# EAGLE design flash programmer (EAGLE 7.4.0)
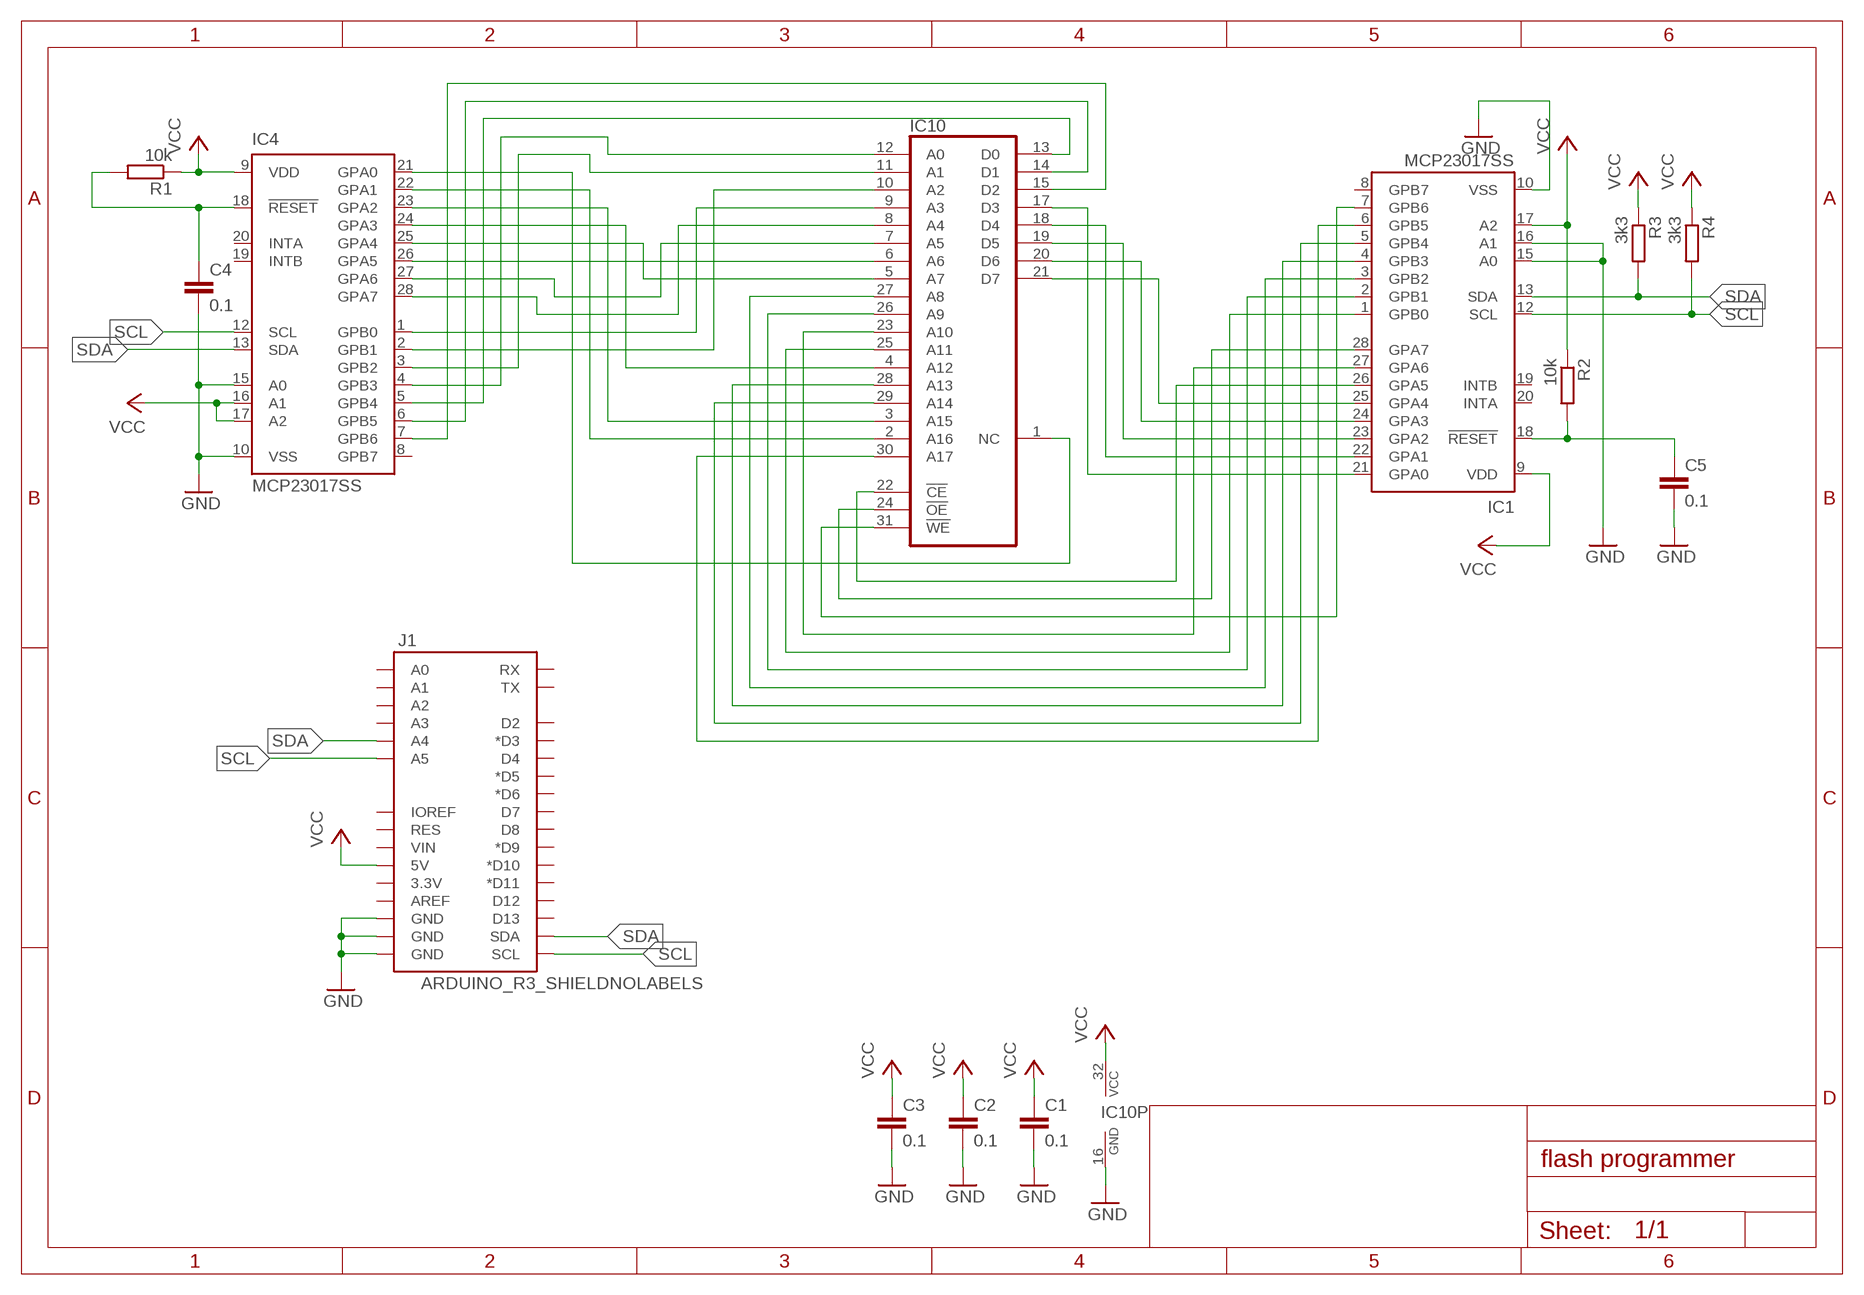
[diagram p0: schematic, sheet 1]

## Parts
C1  0.1  C-EUC0603  [C0603]
C2  0.1  C-EUC0603  [C0603]
C3  0.1  C-EUC0603  [C0603]
C4  0.1  C-EUC0603  [C0603]
C5  0.1  C-EUC0603  [C0603]
IC1  MCP23017SS  [SSOP28]
IC4  MCP23017SS  [SSOP28]
IC10  SST39SF020A-70-4C-PHE  [DIL32]
J1  ARDUINO_R3_SHIELDNOLABELS  [UNO_R3_SHIELD_NOLABELS]
R1  10k  R-EU_R0603  [R0603]
R2  10k  R-EU_R0603  [R0603]
R3  3k3  R-EU_R0603  [R0603]
R4  3k3  R-EU_R0603  [R0603]

## Nets
GND: C1.2 C2.2 C3.2 C4.2 C5.2 IC1.10(VSS) IC1.15(A0) IC1.16(A1) IC4.10(VSS) IC4.15(A0) IC10.16(GND) J1.GND@0(GND) J1.GND@1(GND) J1.GND@2(GND)
N$1: IC4.21(GPA0) IC10.1(NC)
N$2: IC4.22(GPA1) IC10.2(A16)
N$3: IC4.23(GPA2) IC10.3(A15)
N$4: IC4.24(GPA3) IC10.4(A12)
N$5: IC4.25(GPA4) IC10.5(A7)
N$6: IC4.26(GPA5) IC10.6(A6)
N$7: IC4.27(GPA6) IC10.7(A5)
N$8: IC4.28(GPA7) IC10.8(A4)
N$9: IC4.2(GPB1) IC10.10(A2)
N$10: IC4.1(GPB0) IC10.9(A3)
N$11: IC4.3(GPB2) IC10.11(A1)
N$12: IC4.4(GPB3) IC10.12(A0)
N$13: IC4.5(GPB4) IC10.13(D0)
N$14: IC4.6(GPB5) IC10.14(D1)
N$15: IC4.7(GPB6) IC10.15(D2)
N$16: IC1.21(GPA0) IC10.17(D3)
N$17: IC1.22(GPA1) IC10.18(D4)
N$18: IC1.23(GPA2) IC10.19(D5)
N$19: IC1.24(GPA3) IC10.20(D6)
N$20: IC1.25(GPA4) IC10.21(D7)
N$21: IC1.26(GPA5) IC10.22(!CE)
N$22: IC1.27(GPA6) IC10.23(A10)
N$23: IC1.28(GPA7) IC10.24(!OE)
N$24: IC1.1(GPB0) IC10.25(A11)
N$25: IC1.2(GPB1) IC10.26(A9)
N$26: IC1.3(GPB2) IC10.27(A8)
N$27: IC1.4(GPB3) IC10.28(A13)
N$28: IC1.5(GPB4) IC10.29(A14)
N$29: IC1.6(GPB5) IC10.30(A17)
N$30: IC1.7(GPB6) IC10.31(!WE)
N$32: C5.1 IC1.18(!RESET) R2.2
N$33: C4.1 IC4.18(!RESET) R1.2
SCL: IC1.12(SCL) IC4.12(SCL) J1.A5 J1.SCL R4.2
SDA: IC1.13(SDA) IC4.13(SDA) J1.A4 J1.SDA R3.2
VCC: C1.1 C2.1 C3.1 IC1.9(VDD) IC1.17(A2) IC4.9(VDD) IC4.16(A1) IC4.17(A2) IC10.32(VCC) J1.5V R1.1 R2.1 R3.1 R4.1
Unconnected: IC1.8(GPB7) IC1.19(INTB) IC1.20(INTA) IC4.8(GPB7) IC4.19(INTB) IC4.20(INTA) J1.3.3V J1.A0 J1.A1 J1.A2 J1.A3 J1.AREF J1.D2 J1.D3(*D3) J1.D4 J1.D5(*D5) J1.D6(*D6) J1.D7 J1.D8 J1.D9(*D9) J1.D10(*D10) J1.D11(*D11) J1.D12 J1.D13 J1.IOREF J1.RES J1.RX J1.TX J1.VIN

## Library data of the parts
C1-C5 = rcl:C-EU: CAPACITOR, European symbol
IC1 IC4 = adafruit:MCP23017: http://ww1.microchip.com/downloads/en/DeviceDoc/21952a.pdf Source: http://ww1.microchip.com/downloads/en/DeviceDoc/21952a.pdf
IC10 = SST39SF020A-70-4C-PHE:SST39SF020A-70-4C-PHE: MEMORY; OC_FARNELL: unknown; OC_NEWARK: unknown
J1 = SparkFun-Boards:ARDUINO_R3_SHIELD: Shield form compatible with the Arduino Uno R3.
R1-R4 = rcl:R-EU_: RESISTOR, European symbol

## Board
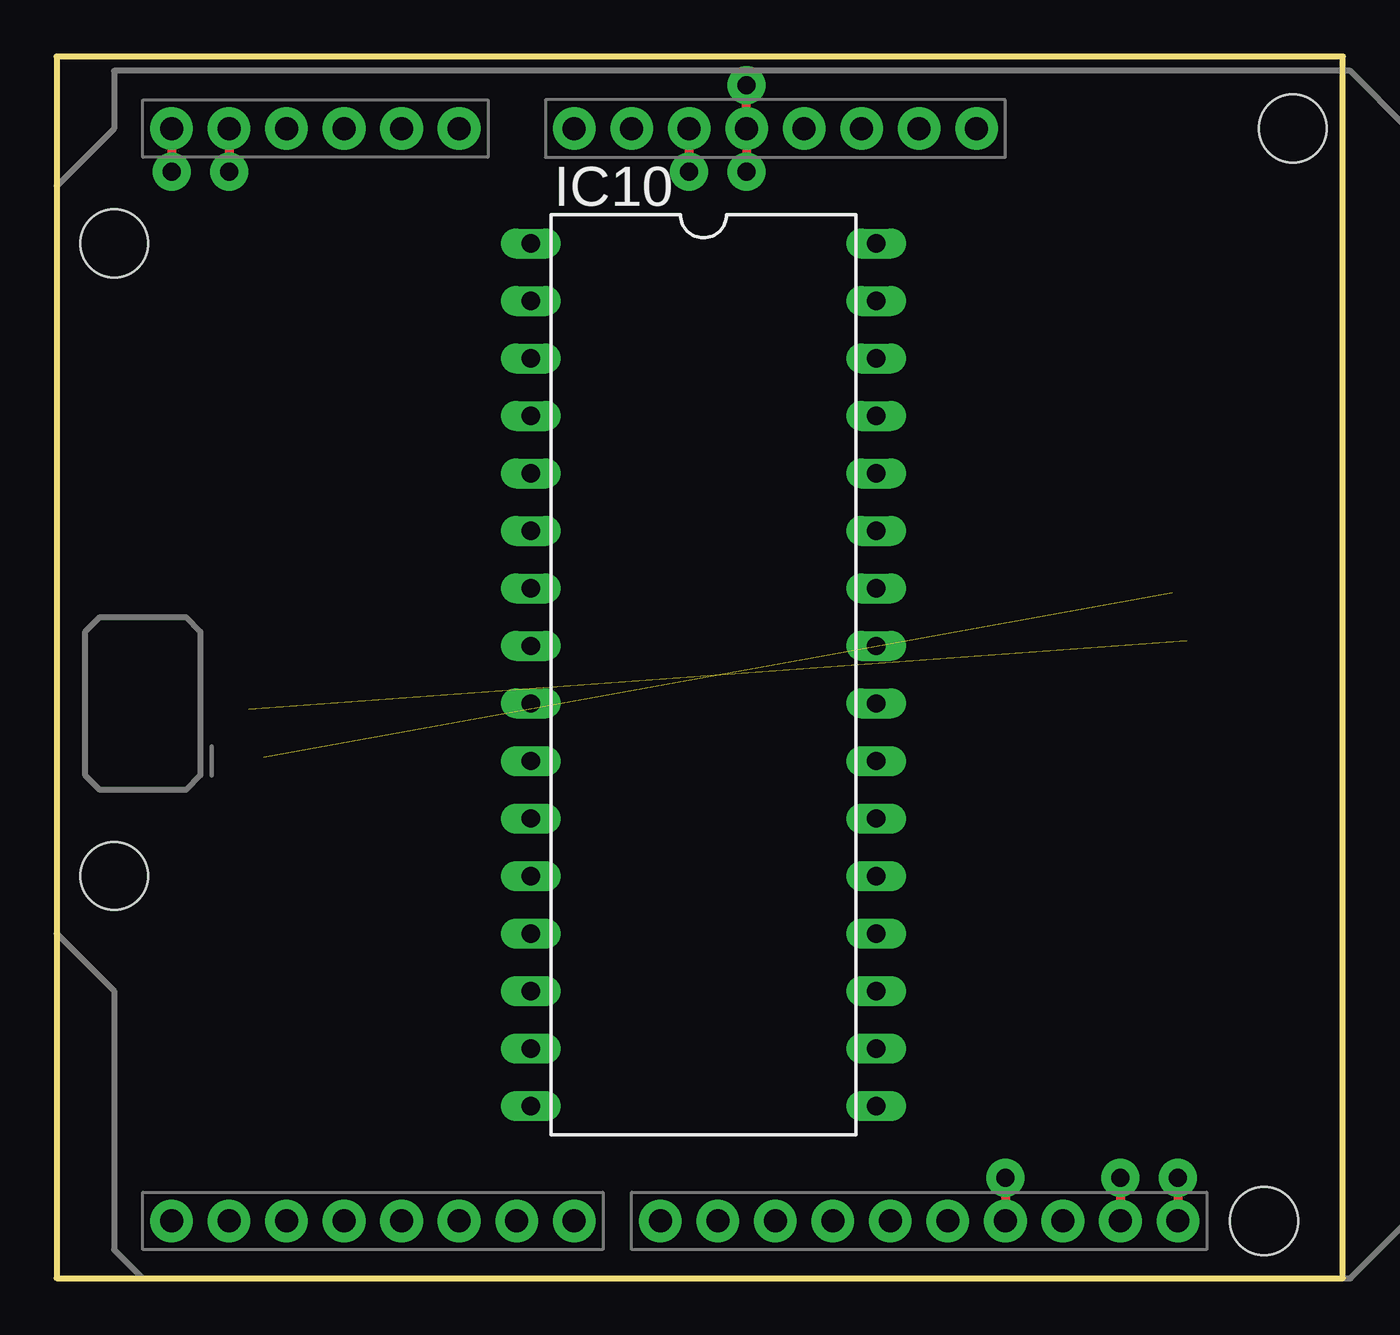
[diagram p1: board, top side]
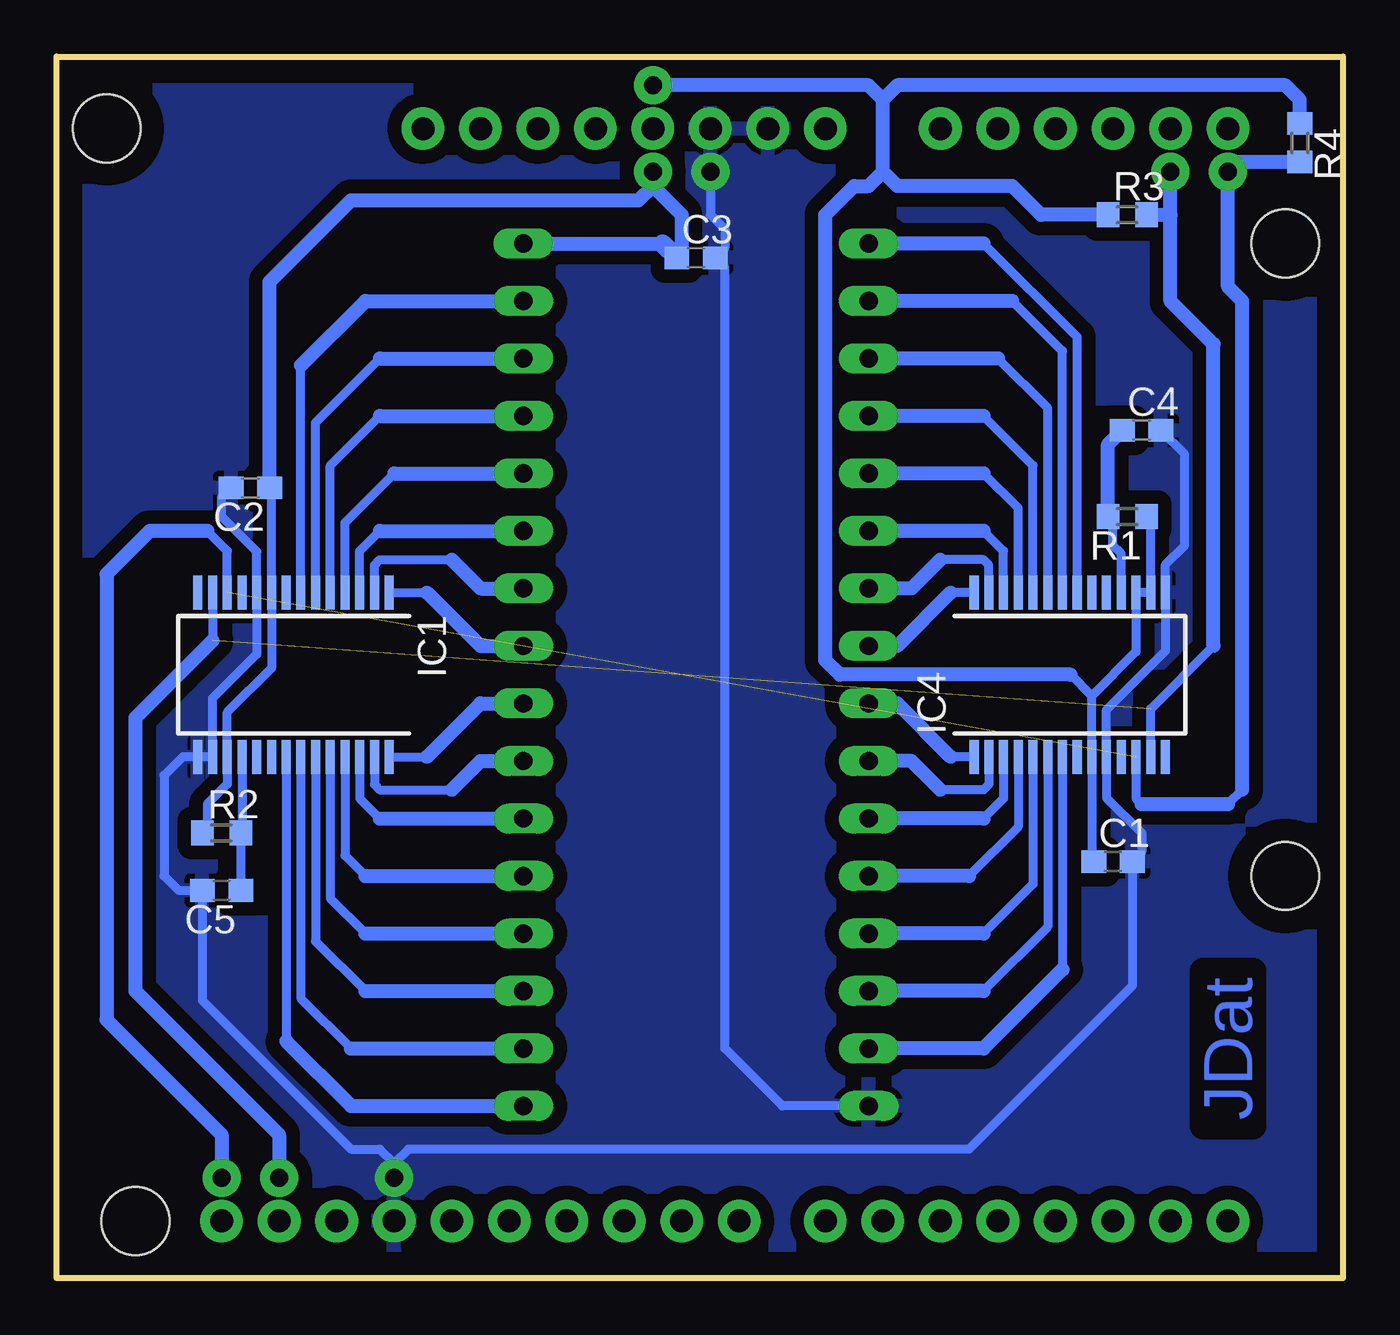
[diagram p2: board, bottom side, seen from below]

Size 56.82 x 53.95 mm. Coordinates in mm from the lower left corner, seen from the top.
Outline: 0,53.95 0,0 56.82,0 56.82,53.95 0,53.95
Copper layers (1*16): Top 0.035mm / dielectric 1.5mm / Bottom 0.035mm
Design rules "default": minimum track width 10mil, minimum drill 24mil, track to track 8mil, track to pad 8mil, pad to pad 8mil, via to via 8mil, smd to smd 8mil, copper to edge 40mil, drill to drill 8mil, minimum pad ring 10mil, minimum via ring 8mil, stop-mask expansion 4mil, vias tented up to drill 0mil, thermal gap 10mil
Holes 3 mm at 2.54,17.76 2.54,45.7 54.61,50.78 53.34,2.52

### Footprints (pad centres in the part's own frame; a part is rotated, then mirrored left to right if it is on the bottom)
C0603 = smd 1.1 x 1: 1 -0.85,0; 2 0.85,0
SSOP28 = smd 0.4 x 1.5: 1 -4.225,-3.625; 2 -3.575,-3.625; 3 -2.925,-3.625; 4 -2.275,-3.625; 5 -1.625,-3.625; 6 -0.975,-3.625; 7 -0.325,-3.625; 8 0.325,-3.625; 9 0.975,-3.625; 10 1.625,-3.625; 11 2.275,-3.625; 12 2.925,-3.625; 13 3.575,-3.625; 14 4.225,-3.625; 15 4.225,3.625; 16 3.575,3.625; 17 2.925,3.625; 18 2.275,3.625; 19 1.625,3.625; 20 0.975,3.625; 21 0.325,3.625; 22 -0.325,3.625; 23 -0.975,3.625; 24 -1.625,3.625; 25 -2.275,3.625; 26 -2.925,3.625; 27 -3.575,3.625; 28 -4.225,3.625
DIL32 = drill 0.813 long: 1 -19.05,-7.62; 2 -16.51,-7.62; 3 -13.97,-7.62; 4 -11.43,-7.62; 5 -8.89,-7.62; 6 -6.35,-7.62; 7 -3.81,-7.62; 8 -1.27,-7.62; 9 1.27,-7.62; 10 3.81,-7.62; 11 6.35,-7.62; 12 8.89,-7.62; 13 11.43,-7.62; 14 13.97,-7.62; 15 16.51,-7.62; 16 19.05,-7.62; 17 19.05,7.62; 18 16.51,7.62; 19 13.97,7.62; 20 11.43,7.62; 21 8.89,7.62; 22 6.35,7.62; 23 3.81,7.62; 24 1.27,7.62; 25 -1.27,7.62; 26 -3.81,7.62; 27 -6.35,7.62; 28 -8.89,7.62; 29 -11.43,7.62; 30 -13.97,7.62; 31 -16.51,7.62; 32 -19.05,7.62
UNO_R3_SHIELD_NOLABELS = drill 1.016 pad 1.88: 3.3V 50.8,26.67; 5V 50.8,29.21; A0 50.8,41.91; A1 50.8,44.45; A2 50.8,46.99; A3 50.8,49.53; A4 50.8,52.07; A5 50.8,54.61; AREF 2.54,15.24; D2 2.54,49.53; D3 2.54,46.99; D4 2.54,44.45; D5 2.54,41.91; D6 2.54,39.37; D7 2.54,36.83; D8 2.54,33.02; D9 2.54,30.48; D10 2.54,27.94; D11 2.54,25.4; D12 2.54,22.86; D13 2.54,20.32; GND@0 50.8,31.75; GND@1 50.8,34.29; GND@2 2.54,17.78; IOREF 50.8,21.59; NC 50.8,19.05; RES 50.8,24.13; RX 2.54,54.61; SCL 2.54,10.16; SDA 2.54,12.7; TX 2.54,52.07; VIN 50.8,36.83
R0603 = smd 1 x 1.1: 1 -0.85,0; 2 0.85,0

### Placement (x,y rotation side)
C1  10.16,18.39 0 bottom
C2  48.26,34.9 180 bottom
C3  28.57,45.06 0 bottom
C4  8.89,37.45 0 bottom
C5  49.53,17.12 180 bottom
IC1  46.35,26.65 180 bottom
IC4  12.06,26.65 0 bottom
IC10  28.57,26.65 270 top
J1  59.69,-0.02 90 top
R1  9.53,33.63 180 bottom
R2  49.53,19.66 0 bottom
R3  9.53,46.97 0 bottom
R4  1.91,50.14 270 bottom

### Tracks (layer width: path | path; a pad name or v marks a point on that pad's centre or on a via)
GND  (via drill 0.8 pad 1.68)
  Top 0.406: J1.GND@0 v27.94,48.88 | v41.91,4.43 J1.GND@2
  Bottom 0.406: IC10.16 24.77,7.6 27.3,10.14 27.3,44.64 C3.2 27.3,45.48 27.3,46.33 27.94,46.97 v27.94,48.88 | C2.2 49.53,34.48 49.53,33.63 47.98,32.08 IC1.10 47.98,27.57 49.93,25.62 IC1.16 IC1.15 51.25,23.03 52.07,22.21 52.07,17.76 51.44,17.12 C5.2 50.38,12.26 43.81,5.7 42.55,5.7 41.91,5.06 | 41.91,5.06 v41.91,4.43 | C4.2 6.99,36.39 6.99,32.36 7.84,31.51 IC4.15 7.84,27.7 10.44,25.1 IC4.10 10.44,21.21 8.89,19.66 8.89,18.82 C1.2 9.31,12.89 16.51,5.7 41.27,5.7 41.91,5.06
  pour Bottom (isolate 0.61): -0.64,-0.66 57.15,-0.66 57.15,54.59 -0.64,54.59
N$1
  Bottom 0.406: IC4.21 11.74,41.56 15.88,45.7
  Bottom 0.61: 15.88,45.7 IC10.1
N$2
  Bottom 0.406: IC4.22 12.39,40.95 14.61,43.16
  Bottom 0.61: 14.61,43.16 IC10.2
N$3
  Bottom 0.406: IC4.23 13.04,38.42 15.24,40.62
  Bottom 0.61: 15.24,40.62 IC10.3
N$4
  Bottom 0.406: IC4.24 13.69,35.89 15.88,38.08
  Bottom 0.61: 15.88,38.08 IC10.4
N$5
  Bottom 0.406: IC4.25 14.34,34 15.88,35.54
  Bottom 0.61: 15.88,35.54 IC10.5
N$6
  Bottom 0.406: IC4.26 14.99,32.11 15.88,33
  Bottom 0.61: 15.88,33 IC10.6
N$7
  Bottom 0.406: IC4.27 15.64,31.5 15.88,31.73 17.78,31.73
  Bottom 0.61: 17.78,31.73 19.05,30.46 IC10.7
N$8
  Bottom 0.406: IC4.28 17.33,30.28
  Bottom 0.61: 17.33,30.28 19.68,27.92 IC10.8
N$9
  Bottom 0.406: IC4.2 15.64,21.8 15.88,21.57 17.78,21.57
  Bottom 0.61: 17.78,21.57 19.05,22.84 IC10.10
N$10
  Bottom 0.406: IC4.1 17.33,23.03
  Bottom 0.61: 17.33,23.03 19.68,25.38 IC10.9
N$11
  Bottom 0.406: IC4.3 14.99,21.18 15.88,20.3
  Bottom 0.61: 15.88,20.3 IC10.11
N$12
  Bottom 0.406: IC4.4 14.34,19.93 16.51,17.76
  Bottom 0.61: 16.51,17.76 IC10.12
N$13
  Bottom 0.406: IC4.5 13.69,17.41 15.88,15.22
  Bottom 0.61: 15.88,15.22 IC10.13
N$14
  Bottom 0.406: IC4.6 13.04,15.52 15.88,12.68
  Bottom 0.61: 15.88,12.68 IC10.14
N$15
  Bottom 0.406: IC4.7 12.39,13.62
  Bottom 0.61: 12.39,13.62 15.88,10.14 IC10.15
N$16
  Bottom 0.406: IC1.21 46.68,10.46
  Bottom 0.61: 46.68,10.46 43.81,7.6 IC10.17
N$17
  Bottom 0.406: IC1.22 46.03,12.36 43.81,10.14
  Bottom 0.61: 43.81,10.14 IC10.18
N$18
  Bottom 0.406: IC1.23 45.38,14.88 43.18,12.68
  Bottom 0.61: 43.18,12.68 IC10.19
N$19
  Bottom 0.406: IC1.24 44.73,16.77 43.18,15.22
  Bottom 0.61: 43.18,15.22 IC10.20
N$20
  Bottom 0.406: IC1.25 44.08,18.66 43.18,17.76
  Bottom 0.61: 43.18,17.76 IC10.21
N$21
  Bottom 0.406: IC1.26 43.43,21.18 42.55,20.3
  Bottom 0.61: 42.55,20.3 IC10.22
N$22
  Bottom 0.406: IC1.27 42.78,21.8 42.55,21.57 39.37,21.57
  Bottom 0.61: 39.37,21.57 38.1,22.84 IC10.23
N$23
  Bottom 0.406: IC1.28 40.45,23.03
  Bottom 0.61: 40.45,23.03 38.1,25.38 IC10.24
N$24
  Bottom 0.406: IC1.1 40.45,30.28
  Bottom 0.61: 40.45,30.28 38.1,27.92 IC10.25
N$25
  Bottom 0.406: IC1.2 42.78,31.5 42.55,31.73 39.37,31.73
  Bottom 0.61: 39.37,31.73 38.1,30.46 IC10.26
N$26
  Bottom 0.406: IC1.3 43.43,32.11 42.55,33
  Bottom 0.61: 42.55,33 IC10.27
N$27
  Bottom 0.406: IC1.4 44.08,33.37 41.91,35.54
  Bottom 0.61: 41.91,35.54 IC10.28
N$28
  Bottom 0.406: IC1.5 44.73,35.89 42.55,38.08
  Bottom 0.61: 42.55,38.08 IC10.29
N$29
  Bottom 0.406: IC1.6 45.38,37.78 42.55,40.62
  Bottom 0.61: 42.55,40.62 IC10.30
N$30
  Bottom 0.406: IC1.7 46.03,40.31
  Bottom 0.61: 46.03,40.31 43.18,43.16 IC10.31
N$32
  Bottom 0.406: IC1.18 48.63,19.71 R2.2 C5.1
N$33
  Bottom 0.406: IC4.18 9.79,32 10.16,32.36 10.16,33.42 R1.2
  Bottom 0.61: R1.2 10.38,36.81 C4.1
SCL  (via drill 0.8 pad 1.68)  (1 unrouted)
  Top 0.406: J1.A5 v5.08,48.88 | v49.53,4.43 J1.SCL
  Bottom 0.406: IC4.12 9.14,21.18 8.89,20.93 | 5.08,20.93 4.45,21.57 | 4.66,49.29 v5.08,48.88 | IC1.12 49.28,32.11 50.16,33
  Bottom 0.61: 8.89,20.93 5.08,20.93 | 4.45,21.57 4.45,43.16 5.08,43.79 v5.08,48.88 | R4.2 4.66,49.29 | 50.16,33 52.7,33 54.61,31.09 54.61,11.41 49.53,6.33 v49.53,4.43
SDA  (via drill 0.8 pad 1.68)  (1 unrouted)
  Top 0.406: J1.A4 v7.62,48.88 | v46.99,4.43 J1.SDA
  Bottom 0.406: IC4.13 8.49,25.14 5.71,27.92 | IC1.13 49.93,28.16
  Bottom 0.61: 5.71,27.92 5.71,41.25 7.62,43.16 7.62,46.97 | 7.62,46.97 v7.62,48.88 | R3.2 7.62,46.97 | 49.93,28.16 53.34,24.75 53.34,12.68 46.99,6.33 v46.99,4.43
VCC  (via drill 0.8 pad 1.68)
  Top 0.406: v30.48,48.88 J1.5V v30.48,52.68
  Bottom 0.406: 29.21,45.28 C3.1 | C1.1 11.09,18.48 IC4.9 11.09,25.72 | R2.1 50.16,19.88 50.16,20.93 49.28,21.82 IC1.17 49.28,25 47.33,26.95 IC1.9 47.33,34.82 C2.1 | R1.1 8.49,33.45 IC4.16 IC4.17 9.14,27.67 11.09,25.72 | 12.02,26.65 11.09,25.72 | 30.48,48.24 v30.48,48.88
  Bottom 0.61: IC10.32 30.06,45.7 | 29.21,45.28 29.21,46.97 30.48,48.24 31.11,47.6 43.81,47.6 47.41,44.01 C2.1 | R3.1 13.34,46.97 14.61,48.24 19.68,48.24 20.32,48.88 | 20.32,48.88 20.95,48.24 21.59,48.24 22.86,46.97 22.86,27.29 22.23,26.65 12.02,26.65 | 20.32,48.88 20.32,52.05 | R4.1 1.91,52.05 2.54,52.68 19.68,52.68 20.32,52.05 | 20.32,52.05 20.95,52.68 v30.48,52.68
  Bottom 0.813: 30.06,45.7 C3.1

### Text on the board
Bottom: JDat